# Altium project Placa controle manipuladores robóticos.PrjPcb
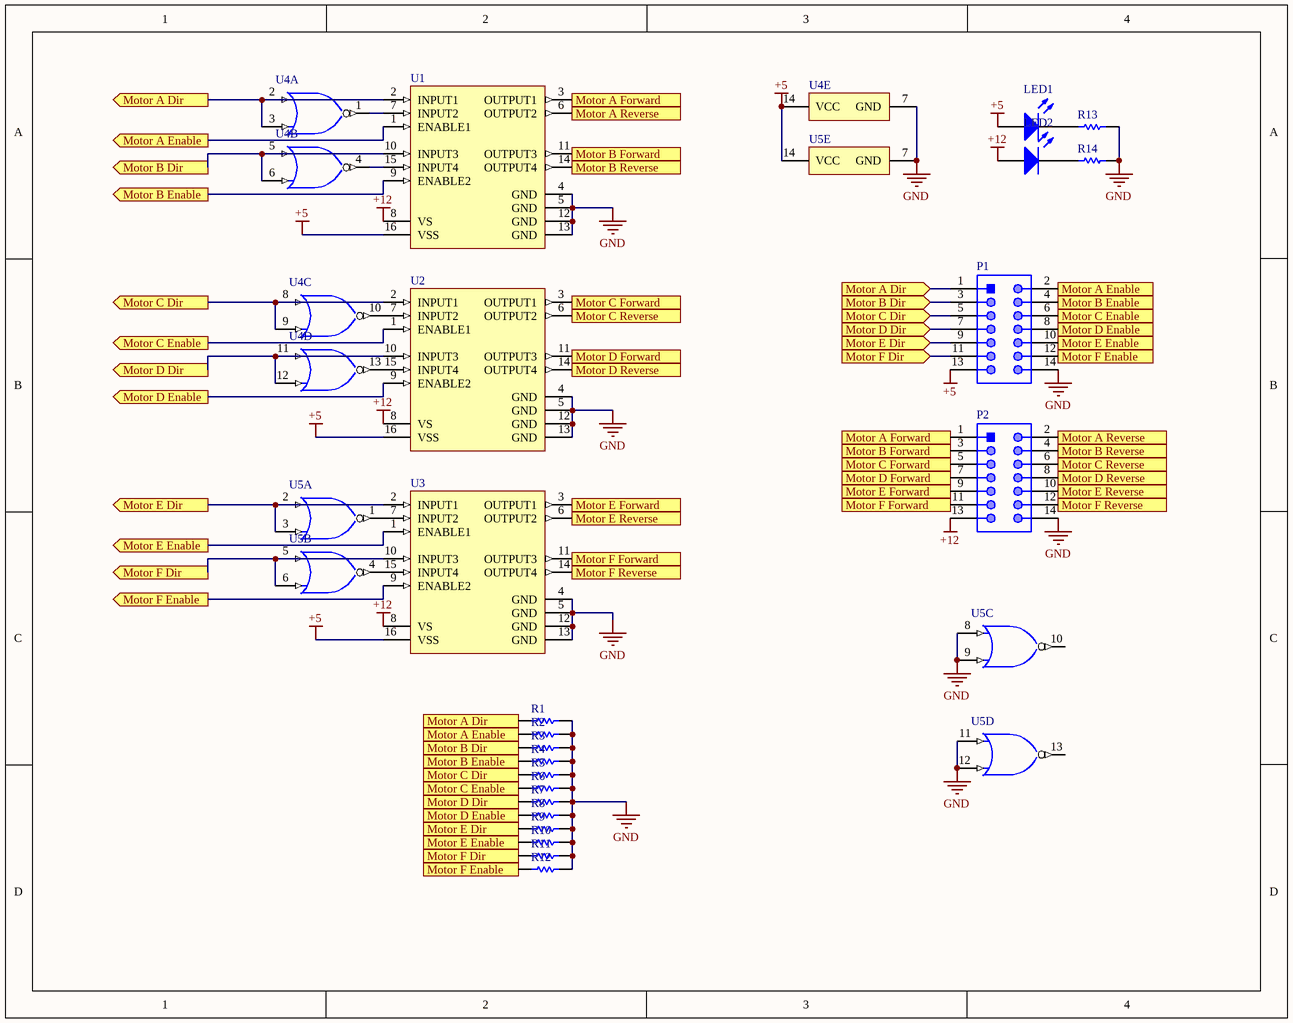
[diagram p0: Schematic.SchDoc]
1 sheet, 23 parts. Net scope: flat (ports and power ports of the same name join across sheets).
Board file: PCB2.PcbDoc

## Sheet Schematic.SchDoc: Placa de Controle
size A; Author: Rafael Dias Campos; SheetNumber: 1; SheetTotal: 1

### Parts
LED1  151051VS04000  [Type 5mm]  (value not drawn)
LED2  151051VS04000  [Type 5mm]  (value not drawn)
P1  61301421121  [61301421121]  (value not drawn)
P2  61301421121  [61301421121]  (value not drawn)
R1  MFR-25FBF52-1K  [RESA60-630X240]  (value not drawn)
R2  MFR-25FBF52-1K  [RESA60-630X240]  (value not drawn)
R3  MFR-25FBF52-1K  [RESA60-630X240]  (value not drawn)
R4  MFR-25FBF52-1K  [RESA60-630X240]  (value not drawn)
R5  MFR-25FBF52-1K  [RESA60-630X240]  (value not drawn)
R6  MFR-25FBF52-1K  [RESA60-630X240]  (value not drawn)
R7  MFR-25FBF52-1K  [RESA60-630X240]  (value not drawn)
R8  MFR-25FBF52-1K  [RESA60-630X240]  (value not drawn)
R9  MFR-25FBF52-1K  [RESA60-630X240]  (value not drawn)
R10  MFR-25FBF52-1K  [RESA60-630X240]  (value not drawn)
R11  MFR-25FBF52-1K  [RESA60-630X240]  (value not drawn)
R12  MFR-25FBF52-1K  [RESA60-630X240]  (value not drawn)
R13  MFR-25FBF52-1K  [RESA60-630X240]  (value not drawn)
R14  MFR-25FBF52-1K  [RESA60-630X240]  (value not drawn)
U1  L293D  [STM-L293D-16]  (value not drawn)
U2  L293D  [STM-L293D-16]  (value not drawn)
U3  L293D  [STM-L293D-16]  (value not drawn)
U4  SN74LS02N  [N0014A]  (value not drawn)  (parts A,B,C,D,E of 5)
U5  SN74LS02N  [N0014A]  (value not drawn)  (parts A,B,C,D,E of 5)

### Ports
Motor A Dir (in, see Schematic[1A], Schematic[2C]), Motor A Dir (out, see Schematic[1A], Schematic[3B]), Motor A Dir (out, see Schematic[2C], Schematic[3B]), Motor A Enable (in, see Schematic[1A], Schematic[2C]), Motor A Enable (out, see Schematic[1A], Schematic[4B]), Motor A Enable (out, see Schematic[2C], Schematic[4B]), Motor A Forward (out, see Schematic[2A]), Motor A Forward (out, see Schematic[3B]), Motor A Reverse (out, see Schematic[2A]), Motor A Reverse (out, see Schematic[4B]), Motor B Dir (in, see Schematic[1A], Schematic[2C]), Motor B Dir (out, see Schematic[1A], Schematic[3B]), Motor B Dir (out, see Schematic[2C], Schematic[3B]), Motor B Enable (in, see Schematic[1A], Schematic[2C]), Motor B Enable (out, see Schematic[1A], Schematic[4B]), Motor B Enable (out, see Schematic[2C], Schematic[4B]), Motor B Forward (out, see Schematic[2A]), Motor B Forward (out, see Schematic[3B]), Motor B Reverse (out, see Schematic[2A]), Motor B Reverse (out, see Schematic[4B]), Motor C Dir (in, see Schematic[1B], Schematic[2D]), Motor C Dir (out, see Schematic[1B], Schematic[3B]), Motor C Dir (out, see Schematic[2D], Schematic[3B]), Motor C Enable (in, see Schematic[1B], Schematic[2D]), Motor C Enable (out, see Schematic[1B], Schematic[4B]), Motor C Enable (out, see Schematic[2D], Schematic[4B]), Motor C Forward (out, see Schematic[2B]), Motor C Forward (out, see Schematic[3B]), Motor C Reverse (out, see Schematic[2B]), Motor C Reverse (out, see Schematic[4B]), Motor D Dir (in, see Schematic[1B], Schematic[2D]), Motor D Dir (out, see Schematic[1B], Schematic[3B]), Motor D Dir (out, see Schematic[2D], Schematic[3B]), Motor D Enable (in, see Schematic[1B], Schematic[2D]), Motor D Enable (out, see Schematic[1B], Schematic[4B]), Motor D Enable (out, see Schematic[2D], Schematic[4B]), Motor D Forward (out, see Schematic[2B]), Motor D Forward (out, see Schematic[3B]), Motor D Reverse (out, see Schematic[2B]), Motor D Reverse (out, see Schematic[4B]), Motor E Dir (in, see Schematic[1B], Schematic[2D]), Motor E Dir (out, see Schematic[1B], Schematic[3B]), Motor E Dir (out, see Schematic[2D], Schematic[3B]), Motor E Enable (in, see Schematic[1C], Schematic[2D]), Motor E Enable (out, see Schematic[1C], Schematic[4B]), Motor E Enable (out, see Schematic[2D], Schematic[4B]), Motor E Forward (out, see Schematic[2B]), Motor E Forward (out, see Schematic[3B]), Motor E Reverse (out, see Schematic[2C]), Motor E Reverse (out, see Schematic[4B]), Motor F Dir (in, see Schematic[1C], Schematic[2D]), Motor F Dir (out, see Schematic[1C], Schematic[3B]), Motor F Dir (out, see Schematic[2D], Schematic[3B]), Motor F Enable (in, see Schematic[1C], Schematic[2D]), Motor F Enable (out, see Schematic[1C], Schematic[4B]), Motor F Enable (out, see Schematic[2D], Schematic[4B]), Motor F Forward (out, see Schematic[2C]), Motor F Forward (out, see Schematic[3B]), Motor F Reverse (out, see Schematic[2C]), Motor F Reverse (out, see Schematic[4B])

### Nets
+5: LED1.2(A) P1.13 U1.16(VSS) U2.16(VSS) U3.16(VSS) U4.14(VCC) U5.14(VCC)
+12: LED2.2(A) P2.13 U1.8(VS) U2.8(VS) U3.8(VS)
GND: P1.14 P2.14 R1.2 R2.2 R3.2 R4.2 R5.2 R6.2 R7.2 R8.2 R9.2 R10.2 R11.2 R12.2 R13.2 R14.2 U1.4(GND) U1.5(GND) U1.12(GND) U1.13(GND) U2.4(GND) U2.5(GND) U2.12(GND) U2.13(GND) U3.4(GND) U3.5(GND) U3.12(GND) U3.13(GND) U4.7(GND) U5.7(GND) U5.8(3A) U5.9(3B) U5.11(4A) U5.12(4B)
NetLED1_1: LED1.1(K) R13.1
NetLED2_1: LED2.1(K) R14.1
NetP1_1: P1.1 R1.1 U1.2(INPUT1) U4.2(1A) U4.3(1B) ; port Motor A Dir
NetP1_2: P1.2 R2.1 U1.1(ENABLE1) ; port Motor A Enable
NetP1_3: P1.3 R3.1 U1.10(INPUT3) U4.5(2A) U4.6(2B) ; port Motor B Dir
NetP1_4: P1.4 R4.1 U1.9(ENABLE2) ; port Motor B Enable
NetP1_5: P1.5 R5.1 U2.2(INPUT1) U4.8(3A) U4.9(3B) ; port Motor C Dir
NetP1_6: P1.6 R6.1 U2.1(ENABLE1) ; port Motor C Enable
NetP1_7: P1.7 R7.1 U2.10(INPUT3) U4.11(4A) U4.12(4B) ; port Motor D Dir
NetP1_8: P1.8 R8.1 U2.9(ENABLE2) ; port Motor D Enable
NetP1_9: P1.9 R9.1 U3.2(INPUT1) U5.2(1A) U5.3(1B) ; port Motor E Dir
NetP1_10: P1.10 R10.1 U3.1(ENABLE1) ; port Motor E Enable
NetP1_11: P1.11 R11.1 U3.10(INPUT3) U5.5(2A) U5.6(2B) ; port Motor F Dir
NetP1_12: P1.12 R12.1 U3.9(ENABLE2) ; port Motor F Enable
NetP2_1: P2.1 U1.3(OUTPUT1) ; port Motor A Forward
NetP2_2: P2.2 U1.6(OUTPUT2) ; port Motor A Reverse
NetP2_3: P2.3 U1.11(OUTPUT3) ; port Motor B Forward
NetP2_4: P2.4 U1.14(OUTPUT4) ; port Motor B Reverse
NetP2_5: P2.5 U2.3(OUTPUT1) ; port Motor C Forward
NetP2_6: P2.6 U2.6(OUTPUT2) ; port Motor C Reverse
NetP2_7: P2.7 U2.11(OUTPUT3) ; port Motor D Forward
NetP2_8: P2.8 U2.14(OUTPUT4) ; port Motor D Reverse
NetP2_9: P2.9 U3.3(OUTPUT1) ; port Motor E Forward
NetP2_10: P2.10 U3.6(OUTPUT2) ; port Motor E Reverse
NetP2_11: P2.11 U3.11(OUTPUT3) ; port Motor F Forward
NetP2_12: P2.12 U3.14(OUTPUT4) ; port Motor F Reverse
NetU1_7: U1.7(INPUT2) U4.1(1Y)
NetU1_15: U1.15(INPUT4) U4.4(2Y)
NetU2_7: U2.7(INPUT2) U4.10(3Y)
NetU2_15: U2.15(INPUT4) U4.13(4Y)
NetU3_7: U3.7(INPUT2) U5.1(1Y)
NetU3_15: U3.15(INPUT4) U5.4(2Y)

Not connected (* = marked no-connect by the designer): U5 10(3Y) 13(4Y)

### Library data of the parts
LED1 LED2 = CMP-1488-00007-1: THT LED round mono-color color lens, WL-TMRW, Bright Green; Manufacturer: Wuerth Elektronik; Emitting color: Bright Green; ComponentLink1Description: Manufacturer URL; PackageReference: Type 5mm; PartNumber: 151051VS04000; ComponentLink2URL: http://katalog.we-online.de/pbs/datasheet/7448042001.pdfhttp://katalog.we-online.de/pbs/datasheet/7448042001.pdfhttp://katalog.we-online.de/pbs/datasheet/7448042001.pdfhttp://katalog.we-online.de/pbs/datasheet/151051VS04000.pdf; ComponentLink1URL: http://www.we-online.com; ComponentLink2Description: Datasheet
P1 P2 = CMP-1502-01093-1: THT Vertical Pin Header WR-PHD, Pitch 2.54 mm, Dual Row, 14 pins; Manufacturer: Wurth Elektronik; Rated Current: 3A; Withstanding Voltage: 500VAC; Gender: Male; Pin Number: 14; Pitch: 2.54mm; Working Voltage: 250VAC; Contact Resistance: 20mOhm; Mounting Technology: THT; Orientation: Vertical; Packaging: Bag; Part Number: 61301421121; Manufacturer URL: http://www.we-online.de; Datasheet URL: https://katalog.we-online.de/em/datasheet/6130xx21121.pdf; Operating Temperature: -40to105degC; Package Reference: 61301421121; Publisher: WurthElektronik; Row Number: Dual
R1-R14 = CMP-1659-00075-1: Axial Resistor, 1 KOhm, +/- 1%, 250 mW, -55 to 155 degC, 2-Pin THD, RoHS, Bulk; Voltage Rating: 250 V; Resistance: 10 kohm; Power Rating: 250 mW; ComponentLink2Description: Datasheet; RoHSCompliant: true; PackageReference: MFR-25; Case\Package: Axial; Max Operating Temperature: 155 degC; DatasheetVersion: Apr-13; Tolerance: 1%; ComponentLink1URL: http://www.yageo.com/; Length: 0.248 inch; ComponentLink2URL: http://www.yageo.com/documents/recent/Yageo%20LR_MFR_2013.pdf; Packaging: Bulk; Package Quantity: 200; PackageDescription: 2-Pin Axial Lead, Dia 2.4 mm, Body Length 6.3 mm; Min Operating Temperature: -55 degC; ComponentLink1Description: Manufacturer URL
U1-U3 = CMP-2000-06524-1: Push-Pull Four Channel Driver with Diode, 4.5 to 36 V, -40 to 150 degC, 16-Pin PDIP, RoHS, Tube; Manufacturer: STMicroelectronics; Number of Outputs: 4; Current - Peak Output: 1.2A; Current - Output / Channel: 600mA; Input Type: Non-Inverting; Other Related Documents: L293DViewAllSpecifications; Dynamic Catalog: HalfBridge; Voltage - Supply: 4.5V~36V; Other Names: 497-2936-5; Package / Case: 16-DIP(0.300",7.62mm); PartNumber: L293D; Operating Temperature: -40°C~150°C; Datasheet URL: http://www.st.com/st-web-ui/static/active/en/resource/technical/document/datasheet/CD00000059.pdf; Supplier Device Package: 16-PowerDIP; Packaging: Tube; Package Description: 16-Pin Thru-Hole Dual-In-Line, Body 20 x 6.85 mm, Pitch 2.54 mm; Standard Package: 25; Datasheet Version: 07/2003; On-State Resistance: -; Manufacturer URL: http://www.st.com/; Category: IntegratedCircuits(ICs); Family: PMIC-MOSFET,BridgeDrivers-InternalSwitch; Type: HalfBridge; Series: -; Mounting Technology: ThroughHole; Package Reference: DIP-16; Mounting Type: ThroughHole
U4 U5 = CMP-0806-00181-3: Quad 2-input positive-NOR gates, N0014A, TUBE; Manufacturer: Texas Instruments; Output Drive (IOL/IOH)(Max)(mA): 0.4/-8; F @ Nom Voltage(Max)(Mhz): 35; VCC(Max)(V): 5.25; Bits(#): 4; Input Type: TTL; VCC(Min)(V): 4.75; ICC @ Nom Voltage(Max)(mA): 0.027; tpd @ Nom Voltage(Max)(ns): 22; Voltage(Nom)(V): 5; Rating: Catalog; Generic Part Number: SN74LS02; PackageReference: N0014A; Operating Temperature Range(C): 0 to 70; DatasheetVersion: SDLS027; PackageVersion: http://www.ti.com/lit/ml/mpdi002c/mpdi002c.pdf; Output Type: TTL; Code_JEDEC: MS-001